# EAGLE design testb_hbridge_current_driver (EAGLE 6.1)
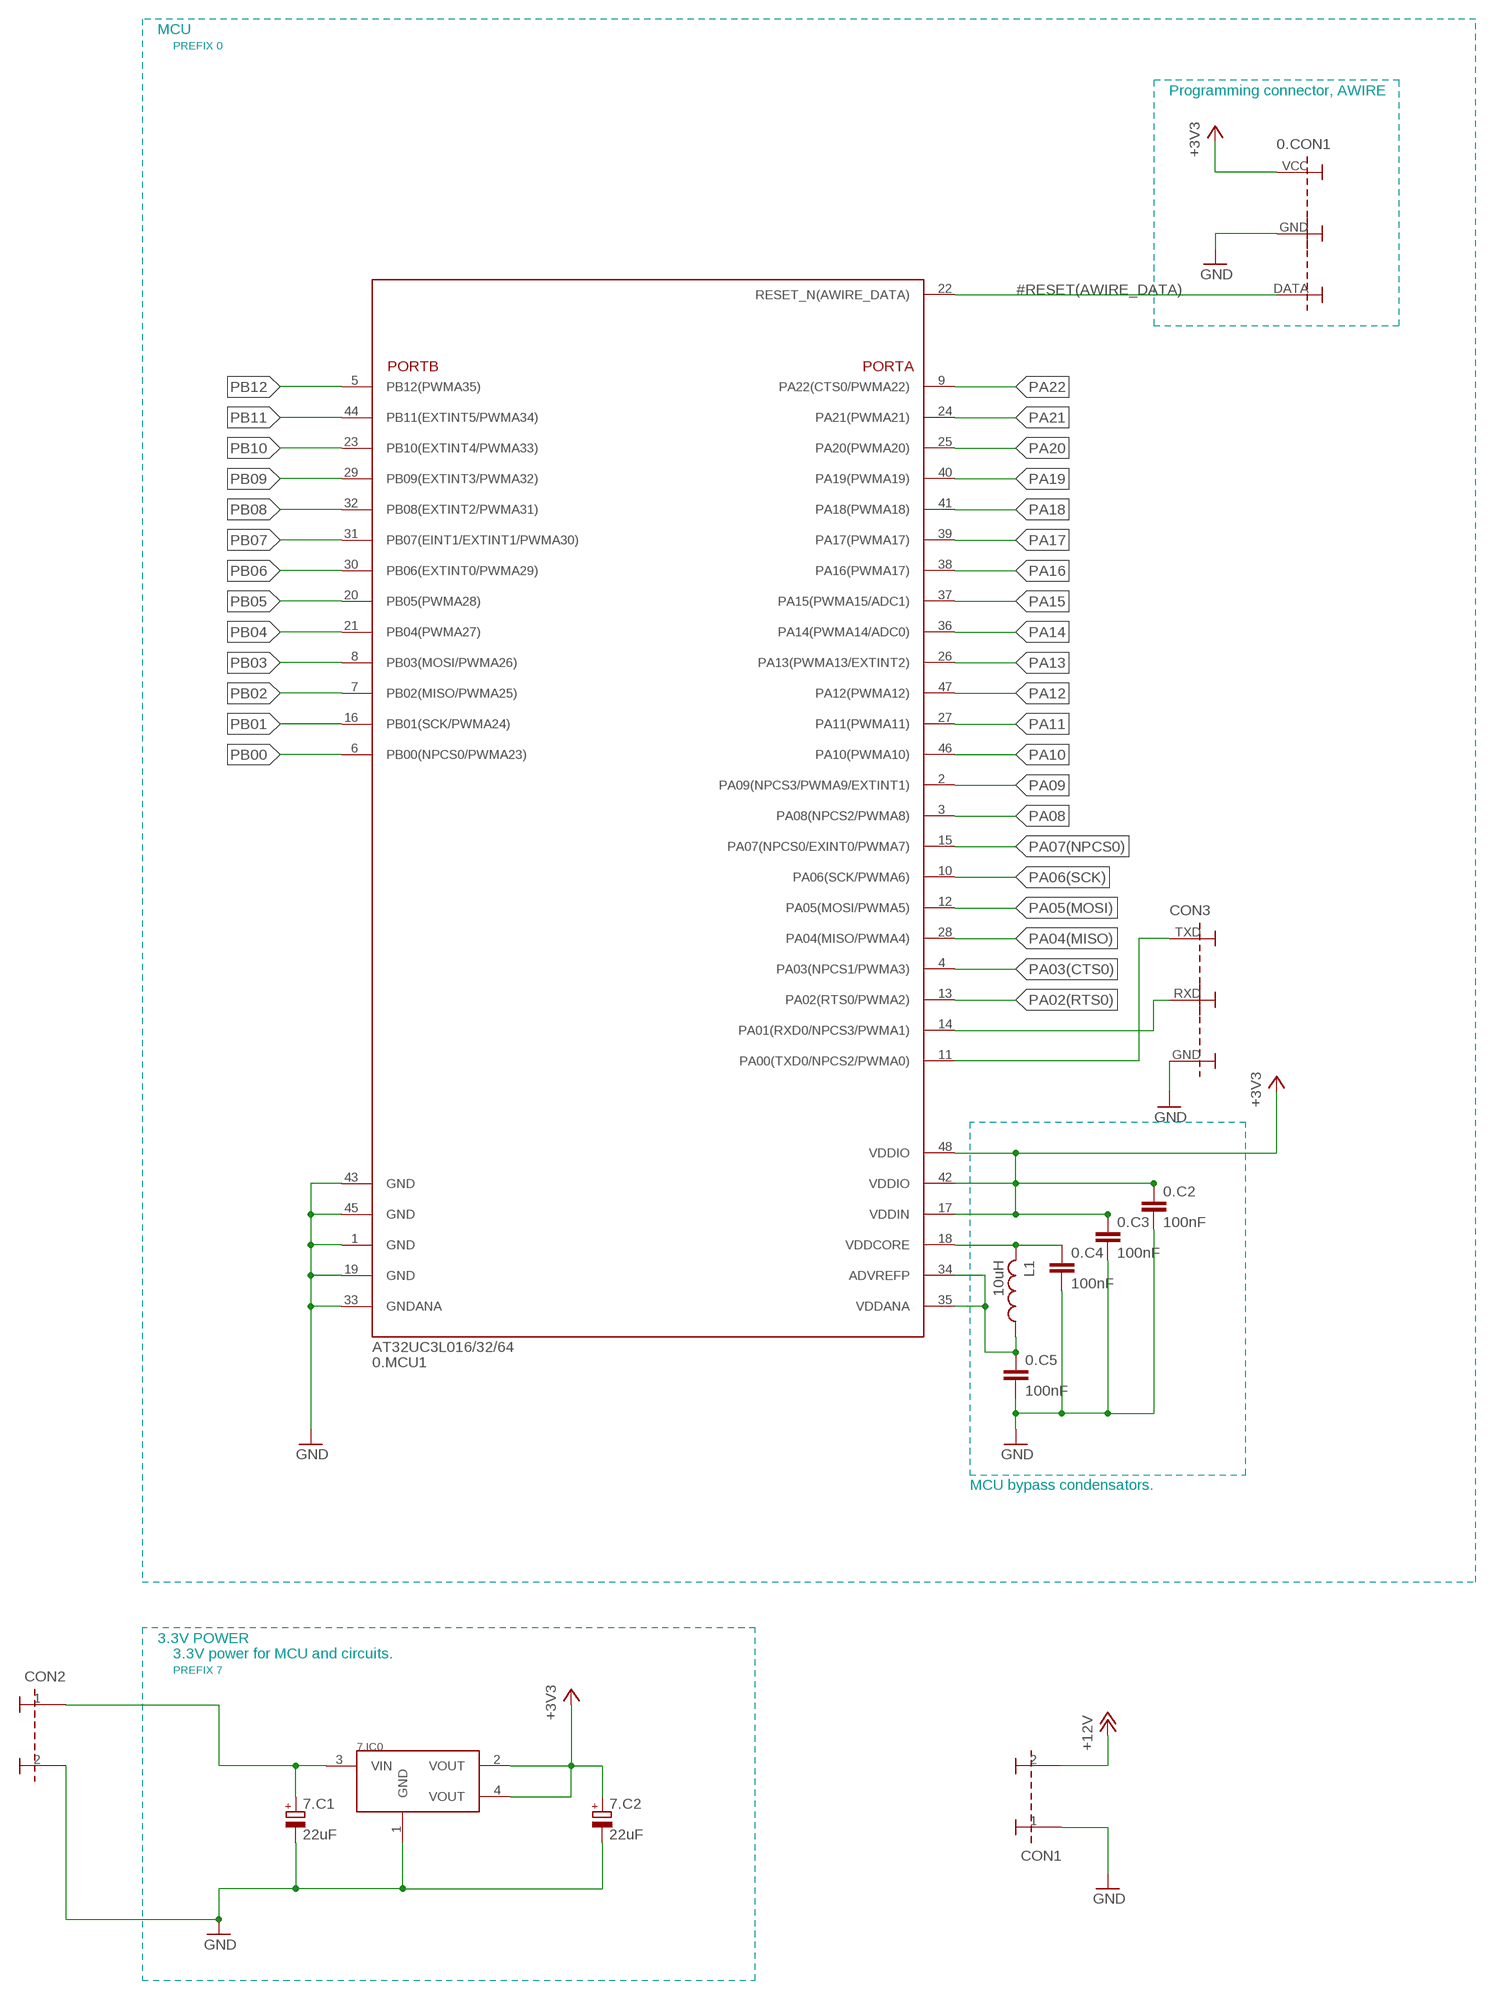
[diagram p0: schematic, sheet 1, part 1 of 2]
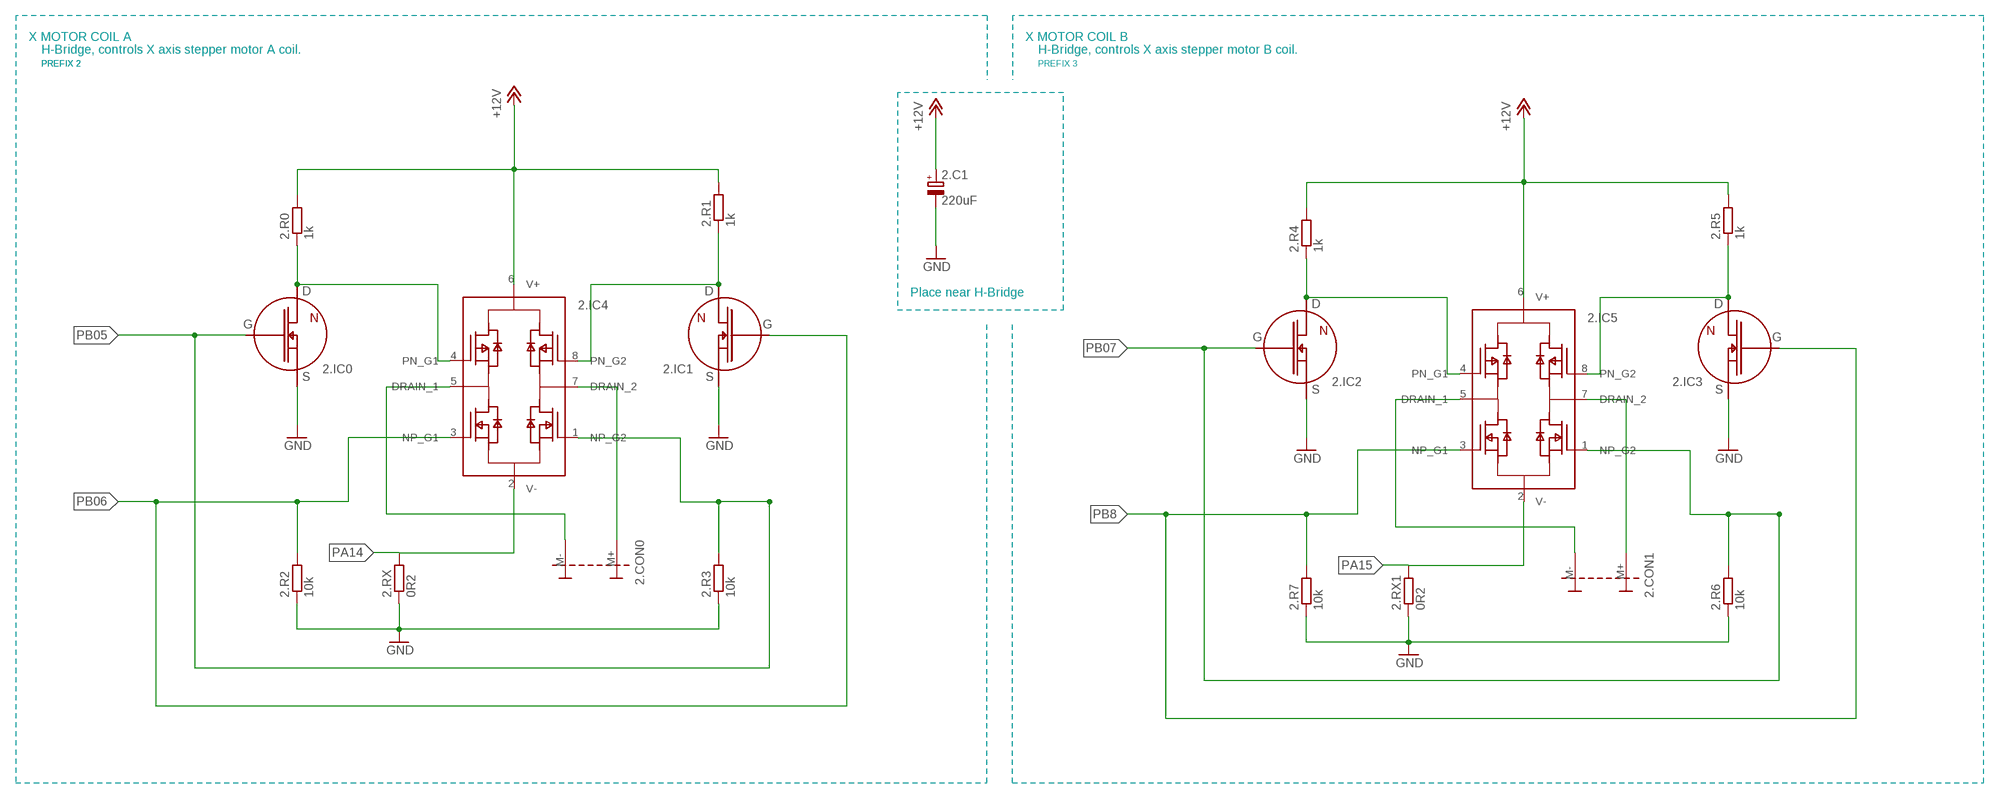
[diagram p1: schematic, sheet 1, part 2 of 2]

## Parts
0.C2  100nF  C-EUC0805  [C0805]
0.C3  100nF  C-EUC0805  [C0805]
0.C4  100nF  C-EUC0805  [C0805]
0.C5  100nF  C-EUC0805  [C0805]
0.CON1  CONNECTOR_3PINAWIRE  [1X3_AWIRE]
0.MCU1  AT32UCL016/32/64_TQFP48  [TQFP48]
2.C1  220uF  CPOL-EUE3.5-8  [E3,5-8]
2.CON0  CONNECTOR_2PIN1X2_MOTOR_COIL  [1X2_MOTOR_COIL_CONNECTOR]
2.CON1  CONNECTOR_2PIN1X2_MOTOR_COIL  [1X2_MOTOR_COIL_CONNECTOR]
2.IC0  N_MOSFET_TSM2N7002  [SOT23]
2.IC1  N_MOSFET_TSM2N7002  [SOT23]
2.IC2  N_MOSFET_TSM2N7002  [SOT23]
2.IC3  N_MOSFET_TSM2N7002  [SOT23]
2.IC4  ZXMHC6A07T8  [ZXMHC6A07T8]
2.IC5  ZXMHC6A07T8  [ZXMHC6A07T8]
2.R0  1k  R-EU_R0805  [R0805]
2.R1  1k  R-EU_R0805  [R0805]
2.R2  10k  R-EU_R0805  [R0805]
2.R3  10k  R-EU_R0805  [R0805]
2.R4  1k  R-EU_R0805  [R0805]
2.R5  1k  R-EU_R0805  [R0805]
2.R6  10k  R-EU_R0805  [R0805]
2.R7  10k  R-EU_R0805  [R0805]
2.RX  0R2  R-EU_R2010  [R2010]
2.RX1  0R2  R-EU_R2010  [R2010]
7.C1  22uF  CPOL-EUE1.5-5  [E1.5-5]
7.C2  22uF  CPOL-EUE1.5-5  [E1.5-5]
7.IC0  REGULATOR_AP1117E33G-13  [SOT223]
CON1  CONNECTOR_2PIN1X2_WIRE  [1X2_WIRE]
CON2  CONNECTOR_2PIN1X2_WIRE  [1X2_WIRE]
CON3  CONNECTOR_3PINUSART  [1X3_USART]
L1  10uH  L_10UH_0805_LB2012T100KR  [C0805]

## Nets
#RESET(AWIRE_DATA): 0.CON1.DATA 0.MCU1.22(RESET_N(AWIRE_DATA))
+3V3 [3V3_LOGIC_POWER]: 0.C2.1 0.C3.1 0.CON1.VCC 0.MCU1.17(VDDIN) 0.MCU1.42(VDDIO) 0.MCU1.48(VDDIO) 7.C2.+ 7.IC0.2(VOUT) 7.IC0.4(VOUT)
+12V [12V_POWER_TRACE]: 2.C1.+ 2.IC4.6(V+) 2.IC5.6(V+) 2.R0.2 2.R1.2 2.R4.2 2.R5.2 CON1.2
GND: 0.C2.2 0.C3.2 0.C4.2 0.C5.2 0.CON1.GND 0.MCU1.1(GND) 0.MCU1.19(GND) 0.MCU1.33(GNDANA) 0.MCU1.43(GND) 0.MCU1.45(GND) 2.C1.- 2.IC0.2(S) 2.IC1.2(S) 2.IC2.2(S) 2.IC3.2(S) 2.R2.1 2.R3.1 2.R6.1 2.R7.1 2.RX1.1 2.RX.1 7.C1.- 7.C2.- 7.IC0.1(GND) CON1.1 CON2.2 CON3.GND
N$1 [12V_POWER_TRACE]: 7.C1.+ 7.IC0.3(VIN) CON2.1
N$2: 2.IC0.3(D) 2.IC4.4(PN_G1) 2.R0.1
N$3: 2.CON0.M+ 2.IC4.7(DRAIN_2)
N$4: 2.CON0.M- 2.IC4.5(DRAIN_1)
N$5: 0.C5.1 0.MCU1.34(ADVREFP) 0.MCU1.35(VDDANA) L1.1
N$6: 0.C4.1 0.MCU1.18(VDDCORE) L1.2
N$7: 2.IC2.3(D) 2.IC5.4(PN_G1) 2.R4.1
N$8: 2.IC1.3(D) 2.IC4.8(PN_G2) 2.R1.1
N$9: 2.IC3.3(D) 2.IC5.8(PN_G2) 2.R5.1
N$10: 2.CON1.M+ 2.IC5.7(DRAIN_2)
N$11: 2.CON1.M- 2.IC5.5(DRAIN_1)
PA00(TXD0): 0.MCU1.11(PA00(TXD0/NPCS2/PWMA0)) CON3.TXD
PA01(RXD0): 0.MCU1.14(PA01(RXD0/NPCS3/PWMA1)) CON3.RXD
PA02(RTS0): 0.MCU1.13(PA02(RTS0/PWMA2))
PA03(CTS0): 0.MCU1.4(PA03(NPCS1/PWMA3))
PA04(MISO): 0.MCU1.28(PA04(MISO/PWMA4))
PA05(MOSI): 0.MCU1.12(PA05(MOSI/PWMA5))
PA06(SCK): 0.MCU1.10(PA06(SCK/PWMA6))
PA07(NPCS0): 0.MCU1.15(PA07(NPCS0/EXINT0/PWMA7))
PA08: 0.MCU1.3(PA08(NPCS2/PWMA8))
PA09: 0.MCU1.2(PA09(NPCS3/PWMA9/EXTINT1))
PA10: 0.MCU1.46(PA10(PWMA10))
PA11: 0.MCU1.27(PA11(PWMA11))
PA12: 0.MCU1.47(PA12(PWMA12))
PA13: 0.MCU1.26(PA13(PWMA13/EXTINT2))
PA14: 0.MCU1.36(PA14(PWMA14/ADC0)) 2.IC4.2(V-) 2.RX.2
PA15: 0.MCU1.37(PA15(PWMA15/ADC1)) 2.IC5.2(V-) 2.RX1.2
PA16: 0.MCU1.38(PA16(PWMA17))
PA17: 0.MCU1.39(PA17(PWMA17))
PA18: 0.MCU1.41(PA18(PWMA18))
PA19: 0.MCU1.40(PA19(PWMA19))
PA20: 0.MCU1.25(PA20(PWMA20))
PA21: 0.MCU1.24(PA21(PWMA21))
PA22: 0.MCU1.9(PA22(CTS0/PWMA22))
PB00: 0.MCU1.6(PB00(NPCS0/PWMA23))
PB01: 0.MCU1.16(PB01(SCK/PWMA24))
PB02: 0.MCU1.7(PB02(MISO/PWMA25))
PB03: 0.MCU1.8(PB03(MOSI/PWMA26))
PB04: 0.MCU1.21(PB04(PWMA27))
PB05: 0.MCU1.20(PB05(PWMA28)) 2.IC0.1(G) 2.IC4.1(NP_G2) 2.R3.2
PB06: 0.MCU1.30(PB06(EXTINT0/PWMA29)) 2.IC1.1(G) 2.IC4.3(NP_G1) 2.R2.2
PB07: 0.MCU1.31(PB07(EINT1/EXTINT1/PWMA30)) 2.IC2.1(G) 2.IC5.1(NP_G2) 2.R6.2
PB08: 0.MCU1.32(PB08(EXTINT2/PWMA31))
PB8: 2.IC3.1(G) 2.IC5.3(NP_G1) 2.R7.2
PB09: 0.MCU1.29(PB09(EXTINT3/PWMA32))
PB10: 0.MCU1.23(PB10(EXTINT4/PWMA33))
PB11: 0.MCU1.44(PB11(EXTINT5/PWMA34))
PB12: 0.MCU1.5(PB12(PWMA35))

## Notes on the sheet
- MCU
- PREFIX 0
- Programming connector, AWIRE
- X MOTOR COIL A | X MOTOR COIL B
- H-Bridge, controls X axis stepper motor A coil. | H-Bridge, controls X axis stepper motor B coil.
- PREFIX 2 | PREFIX 2 | PREFIX 3
- Place near H-Bridge
- MCU bypass condensators.
- 3.3V POWER
- 3.3V power for MCU and circuits.
- PREFIX 7

## Library data of the parts
0.C2-0.C5 = RC_and_L:C-EU: CAPACITOR, European symbol
0.CON1 CON3 = connectors:CONNECTOR_3PIN
0.MCU1 = tlcamera_rail_to_manufacture:AT32UCL016/32/64: Atmel AVR32 family, AT32UCL016-64. In Timelapse Camera Rail 64kBit version is used.; DATASHEET: http://www.farnell.com/datasheets/731602.pdf; FARNELL: http://fi.farnell.com/atmel/at32uc3l032-aut/mcu-32bit-32k-flash-uc3l-48tqfp/dp/1841644
2.C1 7.C1 7.C2 = RC_and_L:CPOL-EU: POLARIZED CAPACITOR, European symbol
2.CON0 2.CON1 = connectors:CONNECTOR_2PIN
2.IC0 2.IC1-2.IC3 = tlcamera_rail_to_manufacture:N_MOSFET: MOSFET, N CHANNEL, SINGLE, 3PIN; DATASHEET: http://www.farnell.com/datasheets/74204.pdf; FARNELL: http://fi.farnell.com/taiwan-semiconductor/tsm2n7002cx/mosfet-n-60v-sot-23/dp/1299313
2.IC4 2.IC5 = tlcamera_rail_to_manufacture:ZXMHC6A07T8: DES INC. - ZXMHC6A07T8TA - MOSFET, BRIDGE, SM8 Farnell <http://fi.farnell.com/diodes-inc/zxmhc6a07t8ta/mosfet-bridge-sm8/dp/7565020RL>
2.R0 2.R1-2.R7 2.RX 2.RX1 = RC_and_L:R-EU_: RESISTOR, European symbol
7.IC0 = tlcamera_rail_to_manufacture:REGULATOR: 3V3 Fixed voltage regulator. (2 pins out).; DATASHEET: http://www.farnell.com/datasheets/608751.pdf; FARNELL: http://fi.farnell.com/diodes-inc/ap1117e33g-13/ic-ldo-reg-3-3v-sot223/dp/1825291
CON1 = connectors:CONNECTOR_2PIN; PIN1: M_GND; PIN2: M_V+
CON2 = connectors:CONNECTOR_2PIN; PIN1: MCU_V+; PIN2: MCU_GND
L1 = tlcamera_rail_to_manufacture:L_10UH_0805_LB2012T100KR: TAIYO YUDEN - LB2012T100KR - INDUCTOR, 0805 CASE, 10UH, 120MA, 10% Farnell <http://fi.farnell.com/taiyo-yuden/lb2012t100kr/inductor-0805-case-10uh-120ma-10/dp/1463501>

## Net classes
1 MOTOR_PWR_COILS: width 0.533 mm
2 MOTOR_PWR_TRACE: width 1.397 mm
3 12V_POWER_TRACE: width 0.762 mm
4 3V3_LOGIC_POWER: width 0.533 mm

## Board
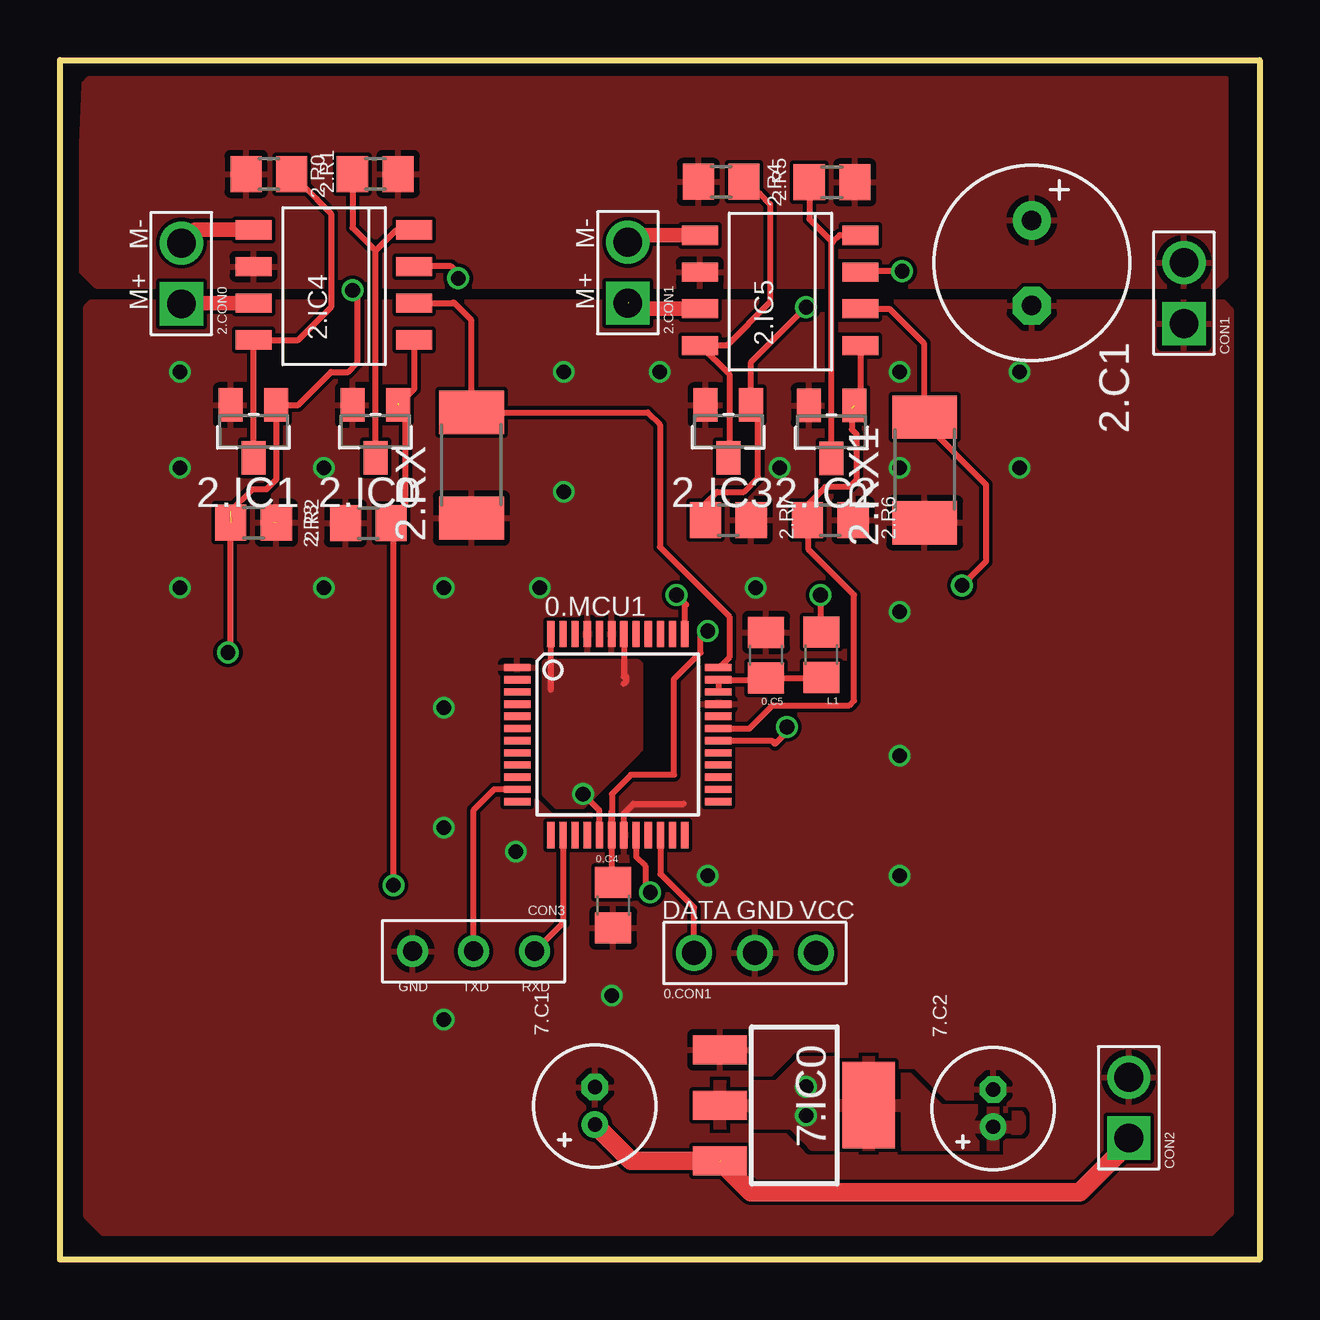
[diagram p2: board, top side]
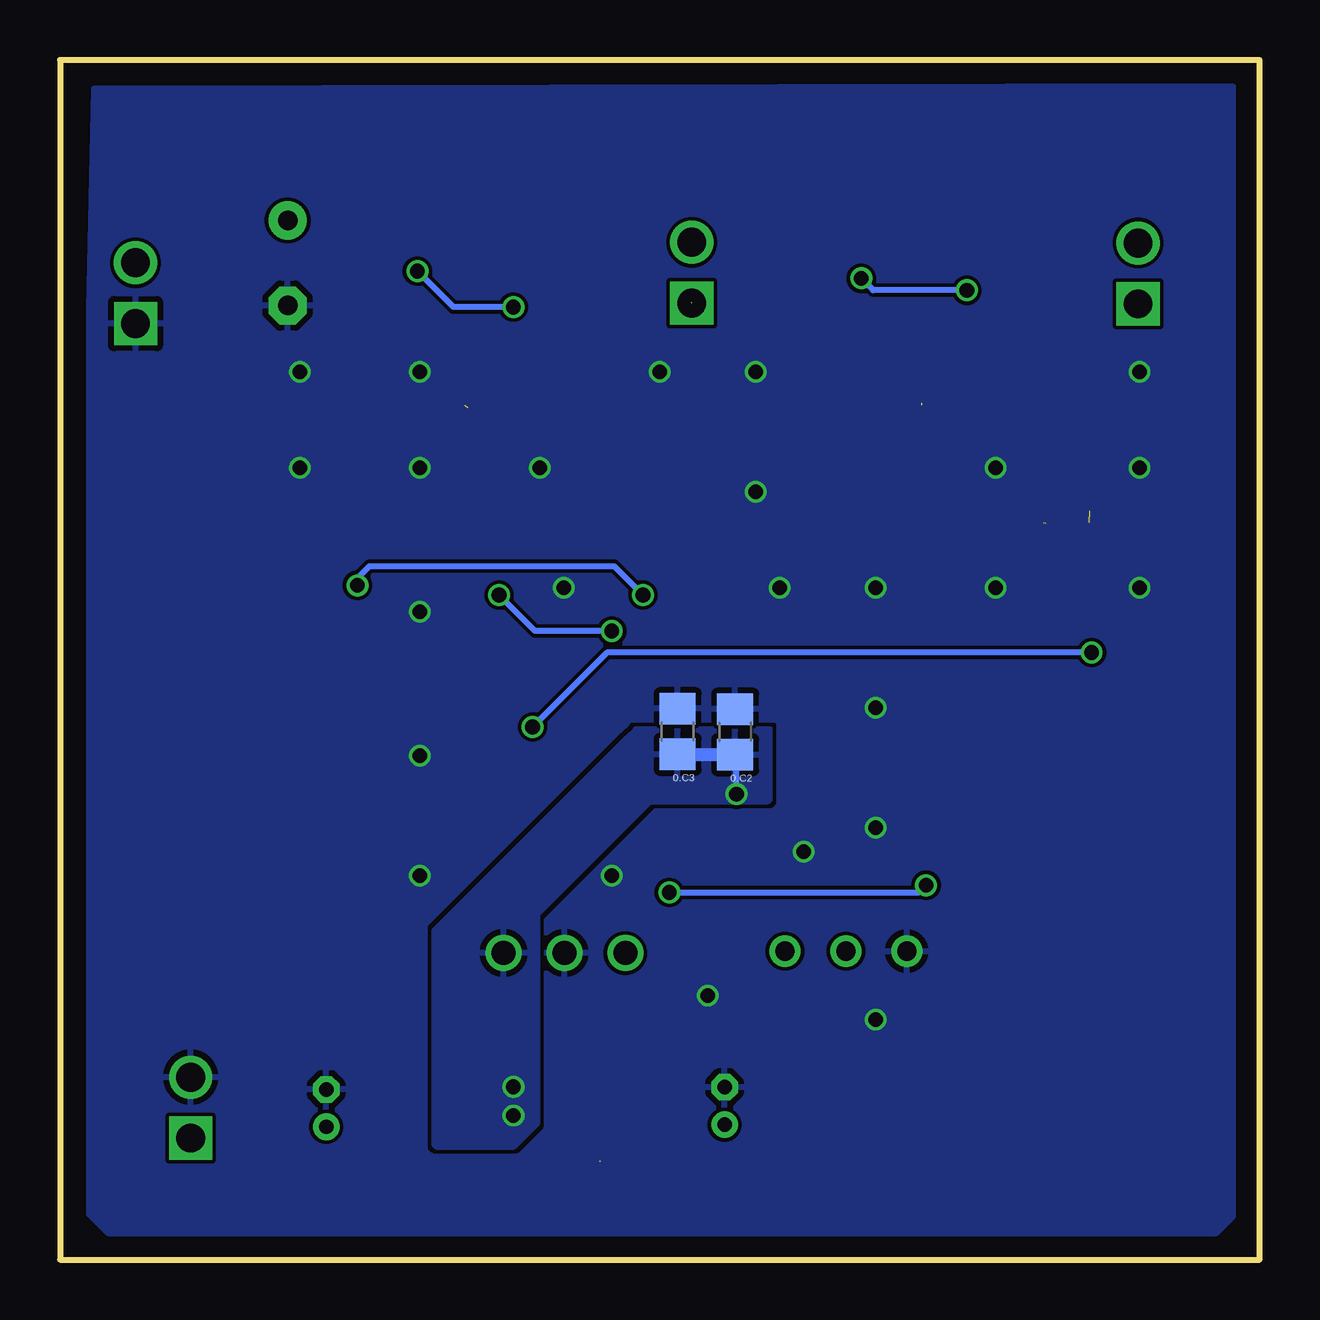
[diagram p3: board, bottom side, seen from below]

Size 50 x 50 mm. Coordinates in mm from the lower left corner, seen from the top.
Outline: 0,0 0,50 50,50 50,0 0,0
Copper layers (1*16): Top 0.035mm / dielectric 1.5mm / Bottom 0.035mm
Design rules: minimum track width 6mil, minimum drill 12mil, track to track 6mil, track to pad 6mil, pad to pad 6mil, via to via 6mil, smd to smd 0mil, copper to edge 10mil, drill to drill 10mil, minimum pad ring 10mil, minimum via ring 6mil, stop-mask expansion 2mil, vias tented up to drill 100mil, thermal gap 10mil

### Footprints (pad centres in the part's own frame; a part is rotated, then mirrored left to right if it is on the bottom)
C0805 = smd 1.3 x 1.5: 1 -0.95,0; 2 0.95,0
1X3_AWIRE = drill 1: DATA -2.54,0; GND 0,0; VCC 2.54,0
TQFP48 = smd 1.1 x 0.3: 1 -4.191,2.794; 2 -4.191,2.286; 3 -4.191,1.778; 4 -4.191,1.27; 5 -4.191,0.762; 6 -4.191,0.254; 7 -4.191,-0.254; 8 -4.191,-0.762; 9 -4.191,-1.27; 10 -4.191,-1.778; 11 -4.191,-2.286; 12 -4.191,-2.794; 25 4.191,-2.794; 26 4.191,-2.286; 27 4.191,-1.778; 28 4.191,-1.27; 29 4.191,-0.762; 30 4.191,-0.254; 31 4.191,0.254; 32 4.191,0.762; 33 4.191,1.27; 34 4.191,1.778; 35 4.191,2.286; 36 4.191,2.794 | smd 0.3 x 1.1: 13 -2.794,-4.191; 14 -2.286,-4.191; 15 -1.778,-4.191; 16 -1.27,-4.191; 17 -0.762,-4.191; 18 -0.254,-4.191; 19 0.254,-4.191; 20 0.762,-4.191; 21 1.27,-4.191; 22 1.778,-4.191; 23 2.286,-4.191; 24 2.794,-4.191; 37 2.794,4.191; 38 2.286,4.191; 39 1.778,4.191; 40 1.27,4.191; 41 0.762,4.191; 42 0.254,4.191; 43 -0.254,4.191; 44 -0.762,4.191; 45 -1.27,4.191; 46 -1.778,4.191; 47 -2.286,4.191; 48 -2.794,4.191
E3,5-8 = drill 0.813 pad 1.6: + -1.778,0 | drill 0.813 pad 1.6 octagon: - 1.778,0
1X2_MOTOR_COIL_CONNECTOR = drill 1.2 square: M+ -1.27,0 | drill 1.2: M- 1.27,0
SOT23 = smd 1 x 1.4: 1 -0.95,-1.1; 2 0.95,-1.1; 3 0,1.1
ZXMHC6A07T8 = smd 0.8 x 1.5: 1 0,-6.7; 2 1.53,-6.7; 3 3.06,-6.7; 4 4.59,-6.7; 5 4.59,0; 6 3.06,0; 7 1.53,0; 8 0,0
R0805 = smd 1.3 x 1.5: 1 -0.95,0; 2 0.95,0
R2010 = smd 1.8 x 2.7: 1 -2.2,0; 2 2.2,0
E1.5-5 = drill 0.6: + -0.77,0 | drill 0.6 octagon: - 0.79,0
SOT223 = smd 1.219 x 2.235: 1 -2.311,-3.099; 2 0,-3.099; 3 2.311,-3.099 | smd 3.6 x 2.2: 4 0,3.099
1X2_WIRE = drill 1.2 square: 1 -1.27,0 | drill 1.2: 2 1.27,0
1X3_USART = drill 0.8: GND 2.54,0; RXD -2.54,0; TXD 0,0

### Placement (x,y rotation side)
0.C2  21.86,21.99 90 bottom
0.C3  24.26,22.01 90 bottom
0.C4  23.06,14.77 270 top
0.C5  29.43,25.19 90 top
0.CON1  28.97,12.78 0 top
0.MCU1  23.25,21.88 0 top
2.C1  40.51,41.54 270 top
2.CON0  5.06,41.1 90 top
2.CON1  23.67,41.13 90 top
2.IC0  13.15,34.52 180 top
2.IC1  8.07,34.52 180 top
2.IC2  32.16,34.5 180 top
2.IC3  27.86,34.52 180 top
2.IC4  8.07,38.33 90 top
2.IC5  26.67,38.1 90 top
2.R0  13.14,45.25 0 top
2.R1  8.71,45.25 180 top
2.R2  8.07,30.71 180 top
2.R3  12.85,30.69 0 top
2.R4  32.18,44.9 0 top
2.R5  27.56,44.92 180 top
2.R6  32.11,30.82 180 top
2.R7  27.86,30.82 180 top
2.RX  17.15,33.11 90 top
2.RX1  36.04,32.91 90 top
7.C1  22.3,6.39 90 top
7.C2  38.9,6.3 90 top
7.IC0  30.61,6.43 270 top
CON1  46.85,40.28 90 top
CON2  44.55,6.33 90 top
CON3  17.24,12.85 180 top
L1  31.73,25.21 90 top

### Tracks (layer width: path | path; a pad name or v marks a point on that pad's centre or on a via)
#RESET(AWIRE_DATA)
  Top 0.254: 0.CON1.DATA 26.43,14.67 25.03,16.07 0.MCU1.22
+3V3  (via drill 0.61)
  Top 0.254: 0.MCU1.17 22.49,18.71 v21.8,19.4 | 0.MCU1.48 20.46,23.74 | 0.MCU1.42 23.5,24.3 23.6,24.2 | 23.6,24.2 23.6,24.3 | 23.6,24.2 23.6,24.1 23.5,24
  Bottom 0.254: v21.8,19.4 21.8,20.98 0.C2.1
  Bottom 0.533: 0.C3.1 21.88,21.06 0.C2.1
  other vias: 31.1,7.2 31.1,6
  pour Top: 27.2,5.7 30.5,5.7 31.4,4.8 39.3,4.8 40,5.5 40,5.9 39.7,6.2 36.7,6.2 34.7,8.2 30.9,8.2 29.9,7.2 27.3,7.2 27.1,7 27.1,5.8
  pour Bottom: 20.4,22.1 26,22.1 26.4,21.7 34.4,13.7 34.4,4.8 34.3,4.7 31.1,4.7 30.1,5.7 30.1,14.4 25.4,19.1 20.5,19.1 20.4,19.2
  pour Top: 24.1,24.9 20.2,24.9 20.2,19.4 20.7,18.9 21.8,18.9 24,21.1 24.2,21.3 24.2,24.8
+12V
  pour Top: 1.5,40.6 48.2,40.6 48.6,41 48.6,49.2 1.2,49.2 1,49 0.9,46.5 0.9,41.2
GND  (via drill 0.61)  (1 unrouted)
  Top 0.254: 8.91,30.69 8.9,30.7 | 8.92,30.81 2.R2.1 | 2.RX.1 17.15,30.55 | 12,30.59 2.R3.1 | 0.MCU1.19 23.5,18.6 23.9,19 26,19
  other vias: 29,28 35,27 35,21 35,16 16,23 16,18 19,17 27,16 23,11 16,10 16,28 20,28 21,32 11,33 5,33 5,37 5,28 11,28 30,33 35,33 40,33 40,37 35,37 25,37 21,37
  pour Top (rank 5): 1.3,39.9 48.5,39.9 48.8,39.6 48.8,1.9 48,1.1 1.8,1.1 1.1,1.8 1.1,39.7
  pour Bottom (rank 5): 1.1,48.9 48.6,48.8 48.8,39.6 48.8,1.9 48,1.1 1.8,1.1 1.1,1.8
N$1  (1 unrouted)
  Top 0.762: CON2.1 44.55,4.85 42.5,2.8 28.8,2.8 27.5,4.1 | 7.IC0.3 23.8,4.12 7.C1.+
N$2
  Top 0.254: 2.IC0.3 13.15,42.05 | 13.15,42.05 14,42.9 14.75,42.9 2.IC4.4 | 2.R0.1 12.19,43.01 13.15,42.05
N$3
  Top 0.61: 2.IC4.7 5.09,39.86 2.CON0.M+
N$4
  Top 0.61: 2.IC4.5 5.61,42.92 2.CON0.M-
N$5
  Top 0.254: 0.MCU1.34 0.MCU1.35 29.36,24.17 0.C5.1 31.71,24.24 L1.1
N$6  (via drill 0.61)
  Top 0.254: 0.MCU1.18 23,15.78 0.C4.1 | 0.MCU1.18 23,18.7 | v27,26.2 26.7,26 26.7,25.3 25.6,24.2 25.6,20.2 23.8,20.2 23,19.4 0.MCU1.18 | v31.7,27.7 31.7,26.19 L1.2
  Bottom 0.254: v27,26.2 30.2,26.2 v31.7,27.7
N$7
  Top 0.254: 2.IC2.3 32.16,42.36 32.2,42.4 | 32.2,42.4 32.5,42.7 2.IC5.4 | 33.4,42.7 2.IC5.4 | 2.IC5.4 | 2.R4.1 31.23,43.37 32.2,42.4
N$8
  Top 0.254: 2.IC1.3 2.IC4.8 9.93,38.33 11.3,39.7 11.3,43.6 10.7,44.2 10.7,44.21 2.R1.1 9.61,45.3 | 9.8,45.1 9.7,45.2 9.7,45.3 9.61,45.3 | 9.6,45.3 9.61,45.3
N$9
  Top 0.254: 2.IC3.3 27.9,33.46 27.9,36.9 26.7,38.1 2.IC5.8 27.8,38.1 29.6,39.9 29.6,44 29.17,44.43 29,44.43 2.R5.1
N$10  (1 unrouted)
  Top 0.61: 2.IC5.7 23.97,39.63 23.7,39.9
N$11
  Top 0.61: 2.IC5.5 23.96,42.69 2.CON1.M-
PA00(TXD0)
  Top 0.254: CON3.TXD 17.24,18.74 18.09,19.59 0.MCU1.11
PA01(RXD0)
  Top 0.254: 0.MCU1.14 20.96,14.03 CON3.RXD
PA14
  Top 0.254: 2.IC4.2 16.36,39.86 16.4,39.9 17.15,39.15 2.RX.2 24.49,35.31 25,34.8 25,29.7 27.9,26.8 27.9,25.1 27.5,24.7 27.47,24.7 0.MCU1.36 27.5,24.73
PA15  (via drill 0.61)
  Top 0.254: 2.IC5.2 34.57,39.63 36,38.2 36,35.15 | 36,35.15 2.RX1.2 | 36,35.15 36,34.9 38.6,32.3 38.6,29.1 v37.6,28.1 | v25.7,27.7 26.1,27.3 26.04,27.24 0.MCU1.37
  Bottom 0.254: v37.6,28.1 37.6,28.4 37.1,28.9 26.9,28.9 v25.7,27.7
PB05  (via drill 0.61)  (1 unrouted)
  Top 0.254: 2.IC4.1 14.77,36.29 2.IC0.1 | 14.1,35.7 14.4,35.4 14.4,31.5 13.8,30.9 2.R3.2 13.9,30.59 v13.9,15.6 | 0.MCU1.20 24.01,16.79 24.4,16.4 24.4,15.5 v24.6,15.3
  Bottom 0.254: v24.6,15.3 14.2,15.3 v13.9,15.6
PB06  (via drill 0.61)  (1 unrouted)
  Top 0.254: 14.88,41.5 2.IC4.3 14.8,41.42 14.8,41.5 | v12.2,40.4 12.4,40.2 12.4,37.4 12,37 11.3,37 9.92,35.62 2.IC1.1 9.02,32.52 8.6,32.1 8,32.1 7.1,31.2 7.1,25.4 v7,25.3 | v16.6,40.9 16.6,41.1 16.3,41.4 14.9,41.4 14.8,41.5 | 14.8,41.5 14.7,41.5 14.6,41.4 | v30.3,22.2 30.3,22 29.8,21.5 29.67,21.63 0.MCU1.30
  Bottom 0.254: v12.2,40.4 16.1,40.4 v16.6,40.9 | v7,25.3 27.2,25.3 v30.3,22.2
PB07  (1 unrouted)
  Top 0.254: 2.IC5.1 33.37,35.87 33,35.5 33,34.6 33.2,34.4 33.2,32.5 32.9,32.2 31.9,32.2 31.2,31.5 31.2,30.86 2.R6.2 31.2,30.78 31.2,29.6 33.1,27.7 33.1,23.3 32.9,23.1 29.7,23.1 28.73,22.13 0.MCU1.31
PB8  (via drill 0.61)
  Top 0.254: 2.R7.2 26.91,31.51 27.4,32 28.5,32 29.1,32.6 29.1,35.4 28.8,35.7 29,35.9 29.09,35.9 | 29.1,35.9 29.09,35.9 | 29.09,35.9 2.IC3.1 28.81,37.41 v31.1,39.7 | v35.1,41.2 33.41,41.2 2.IC5.3
  Bottom 0.254: v31.1,39.7 33.6,39.7 v35.1,41.2